# Altium schematic sheet 1 power.SchDoc
size A4; DocumentNumber: 1; SheetNumber: 3; SheetTotal: 12
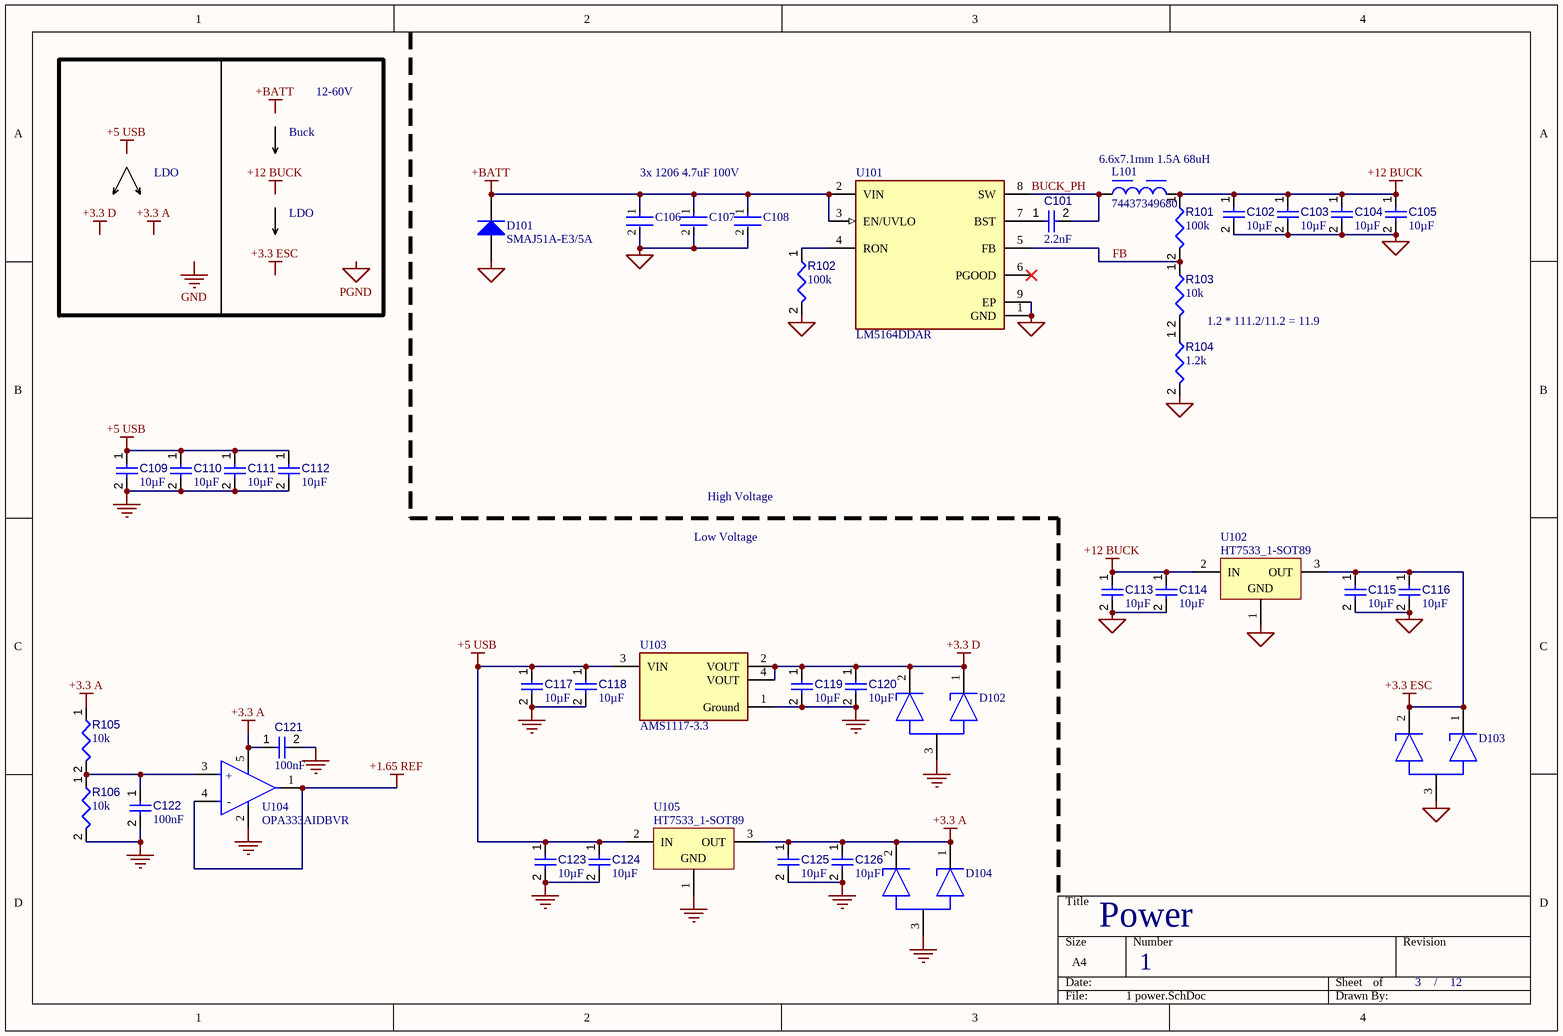
[diagram p0: 1 power.SchDoc]

## Parts
C101  value 2.2nF  [CAPC0402(1005)33_L]  (hidden comment: Capacitor 2.2nF +/-20% 50V 0402)
C102  value 10µF  [CAPC0603(1608)100_L]  (hidden comment: Capacitor 10µF +/-20% 10V 0603)
C103  value 10µF  [CAPC0603(1608)100_L]  (hidden comment: Capacitor 10µF +/-20% 10V 0603)
C104  value 10µF  [CAPC0603(1608)100_L]  (hidden comment: Capacitor 10µF +/-20% 10V 0603)
C105  value 10µF  [CAPC0603(1608)100_L]  (hidden comment: Capacitor 10µF +/-20% 10V 0603)
C106  12061Z475KAT2A  [FP-1206-L_3_2_0_2-W_1_6_0-MFG]  (value not drawn)
C107  12061Z475KAT2A  [FP-1206-L_3_2_0_2-W_1_6_0-MFG]  (value not drawn)
C108  12061Z475KAT2A  [FP-1206-L_3_2_0_2-W_1_6_0-MFG]  (value not drawn)
C109  value 10µF  [CAPC0603(1608)100_L]  (hidden comment: Capacitor 10µF +/-20% 10V 0603)
C110  value 10µF  [CAPC0603(1608)100_L]  (hidden comment: Capacitor 10µF +/-20% 10V 0603)
C111  value 10µF  [CAPC0603(1608)100_L]  (hidden comment: Capacitor 10µF +/-20% 10V 0603)
C112  value 10µF  [CAPC0603(1608)100_L]  (hidden comment: Capacitor 10µF +/-20% 10V 0603)
C113  value 10µF  [CAPC0603(1608)100_L]  (hidden comment: Capacitor 10µF +/-20% 10V 0603)
C114  value 10µF  [CAPC0603(1608)100_L]  (hidden comment: Capacitor 10µF +/-20% 10V 0603)
C115  value 10µF  [CAPC0603(1608)100_L]  (hidden comment: Capacitor 10µF +/-20% 10V 0603)
C116  value 10µF  [CAPC0603(1608)100_L]  (hidden comment: Capacitor 10µF +/-20% 10V 0603)
C117  value 10µF  [CAPC0603(1608)100_L]  (hidden comment: Capacitor 10µF +/-20% 10V 0603)
C118  value 10µF  [CAPC0603(1608)100_L]  (hidden comment: Capacitor 10µF +/-20% 10V 0603)
C119  value 10µF  [CAPC0603(1608)100_L]  (hidden comment: Capacitor 10µF +/-20% 10V 0603)
C120  value 10µF  [CAPC0603(1608)100_L]  (hidden comment: Capacitor 10µF +/-20% 10V 0603)
C121  value 100nF  [CAPC0402(1005)60_L]  (hidden comment: Capacitor 100nF +/-20% 25V 0402)
C122  value 100nF  [CAPC0402(1005)60_L]  (hidden comment: Capacitor 100nF +/-20% 25V 0402)
C123  value 10µF  [CAPC0603(1608)100_L]  (hidden comment: Capacitor 10µF +/-20% 10V 0603)
C124  value 10µF  [CAPC0603(1608)100_L]  (hidden comment: Capacitor 10µF +/-20% 10V 0603)
C125  value 10µF  [CAPC0603(1608)100_L]  (hidden comment: Capacitor 10µF +/-20% 10V 0603)
C126  value 10µF  [CAPC0603(1608)100_L]  (hidden comment: Capacitor 10µF +/-20% 10V 0603)
D101  SMAJ51A-E3/5A  [VISH-DO-214AC-2_N]
D102  PESD3V3S2UT,215  [FP-SOT23-IPC_A]  (value not drawn)
D103  PESD3V3S2UT,215  [FP-SOT23-IPC_A]  (value not drawn)
D104  PESD3V3S2UT,215  [FP-SOT23-IPC_A]  (value not drawn)
L101  74437349680  [WE-LHMI_7050]
R101  value 100k  [RESC0402(1005)_L]  (hidden comment: Resistor 100K +/-1 % 0402 63 mW)
R102  value 100k  [RESC0402(1005)_L]  (hidden comment: Resistor 100K +/-1 % 0402 63 mW)
R103  value 10k  [RESC0402(1005)_L]  (hidden comment: Resistor 10K  +/-1 % 0402 63 mW)
R104  value 1.2k  [RESC0402(1005)_L]  (hidden comment: Resistor 1K2 +/-1 % 0402 63 mW)
R105  value 10k  [RESC0402(1005)_L]  (hidden comment: Resistor 10K  +/-1 % 0402 63 mW)
R106  value 10k  [RESC0402(1005)_L]  (hidden comment: Resistor 10K  +/-1 % 0402 63 mW)
U101  LM5164DDAR  [FP-DDA0008E-MFG]
U102  HT7533_1-SOT89  [SOT89_L]
U103  AMS1117-3.3  [FP-AMS1117-IPC_C]
U104  OPA333AIDBVR  [FP-DBV0005A-MFG]
U105  HT7533_1-SOT89  [SOT89_L]

## Nets
+1.65 REF: U104.1(OUT) U104.4(-IN)
+3.3 A: C121.1 C125.1 C126.1 D104.1 D104.2 R105.1 U104.5(V+) U105.3(OUT)
+3.3 D: C119.1 C120.1 D102.1 D102.2 U103.2(VOUT) U103.4(VOUT)
+3.3 ESC: C115.1 C116.1 D103.1 D103.2 U102.3(OUT)
+5 USB: C109.1 C110.1 C111.1 C112.1 C117.1 C118.1 C123.1 C124.1 U103.3(VIN) U105.2(IN)
+12 BUCK: C102.1 C103.1 C104.1 C105.1 C113.1 C114.1 L101.2 R101.1 U102.2(IN)
+BATT: C106.1 C107.1 C108.1 D101.1(K) U101.2(VIN) U101.3(EN/UVLO)
GND: C109.2 C110.2 C111.2 C112.2 C117.2 C118.2 C119.2 C120.2 C121.2 C122.2 C123.2 C124.2 C125.2 C126.2 D102.3 D104.3 R106.2 U103.1(Ground) U104.2(V-) U105.1(GND)
PGND: C102.2 C103.2 C104.2 C105.2 C106.2 C107.2 C108.2 C113.2 C114.2 C115.2 C116.2 D101.2(A) D103.3 R102.2 R104.2 U101.1(GND) U101.9(EP) U102.1(GND)
BUCK_PH: C101.2 L101.1 U101.8(SW)
FB: R101.2 R103.1 U101.5(FB)
NetC101_1: C101.1 U101.7(BST)
NetC122_1: C122.1 R105.2 R106.1 U104.3(+IN)
NetR102_1: R102.1 U101.4(RON)
NetR103_2: R103.2 R104.1

Not connected (* = marked no-connect by the designer): U101 6(PGOOD)*

## Notes on the sheet
- 12-60V
- LDO
- Buck
- 3x 1206 4.7uF 100V
- 6.6x7.1mm 1.5A 68uH
- 1.2 * 111.2/11.2 = 11.9
- High Voltage
- Low Voltage
- Power
- /
- Labels drawn without touching a wire or pin: +3.3 A, +3.3 D, +3.3 ESC, +5 USB, +12 BUCK, +BATT, GND, PGND
- (in symbol CMP-0272-00862-4) +; -

## Library data of the parts
C101 = CMP-001-00066-3: Chip Capacitor, 1nF +/-20%, 50V, 0402, Thickness 0.33 mm; Tolerance: 10%; Case/Package: 0402; Pins: 2; Min Operating Temperature: -55°C; Max Operating Temperature: 85°C; Voltage Rating: 50V; Mounting Technology: SMT
C102-C105 C109-C120 C123-C126 = CMP-001-00075-4: Chip Capacitor, 10µF +/-20%, 10V, 0603, Thickness 1 mm; Tolerance: 10%; Voltage Rating: 10V; Max Operating Temperature: 85°C; Pins: 2; Case/Package: 0603; Mounting Technology: SMT; Min Operating Temperature: -55°C
C106-C108 = CMP-2000-05019-2: CAP CER 4.7UF 100V X7S 1206; Tolerance: 10%; Thickness: 0.075inch; Max Operating Temperature: 125°C; Termination: SMD/SMT; Dielectric: X7S; Case Code (Metric): 3216; Case/Package: 1206; Height: 0.5mm; Mount: Surface Mount; Voltage Rating (DC): 100V; Min Operating Temperature: -55°C; Package Quantity: 1; Length: 3.2mm; Voltage Rating: 100V; Lead Free: Lead Free; RoHS Compliant: Yes; Packaging: Tape and Reel; Weight: 0.000571oz; Capacitance: 4.7uF; REACH SVHC: No SVHC; Case Code (Imperial): 1206; Width: 0.063inch; Depth: 1.6mm
C121 C122 = CMP-001-00065-4: Chip Capacitor, 100nF +/-20%, 25V, 0402, Thickness 0.6 mm; Tolerance: 10%; Max Operating Temperature: 85°C; Min Operating Temperature: -55°C; Pins: 2; Voltage Rating: 25V; Mounting Technology: SMT; Case/Package: 0402
D101 = CMP-0544-00031-2: Transient Voltage Suppressor, 6.40 to 231 V, 51 V Stand-off Voltage, Uni-Directional, -55 to 155 degC, 2-pin DO-214AC, Pb-Free, Tape and Reel; Manufacturer: Vishay Semiconductor; IFSM: 40 A; ID (uA): 1; VBR Uni-Directional (V): 6.4 to 231; PPPM (W): 400, 300; VWM (V): 51; ComponentLink3Description: Package Specification; PackageDescription: 2-Pin DO-214AC (SMA), Body 4.245 x 2.665 mm; ComponentLink1Description: Manufacturer URL; ComponentLink2Description: Datasheet; ComponentLink3URL: http://www.vishay.com/docs/88390/smaj50a.pdf; DatasheetVersion: 12/8/2013; ComponentLink2URL: http://www.vishay.com/docs/88390/smaj50a.pdf; PackageReference: DO-214AC-2; RoHS: TRUE; Operating Junction and Storage Temperature Range: -55 to 150 degC; ComponentLink1URL: http://www.vishay.com/; PartNumber: SMAJ51A-E3/5A; Packing: Tape and Reel; Mounting Technology: Surface Mount
D102-D104 = CMP-14432-000008-1: TVS DIODE 3.3VWM 20VC TO236AB; RoHS Compliant: Yes
L101 = CMP-1353-00069-6: NexarPartId: 65255814; Inductance Tolerance: 20%; Saturation Current: 1.45A; Inductance: 68µH; DC Resistance (DCR): 386mΩ; Ambient Temperature Range High: 85°C; Ambient Temperature Range Low: -40°C; RoHS: Compliant; Length: 7.3mm; Min Operating Temperature: -40°C; Max Operating Temperature: 125°C; Height: 4.8mm; Width: 6.6mm
R101 R102 = CMP-009-00168-3: Chip Resistor, 100 kOhms, +/-1 %, 63 mW, -55 to 155 degC, 0402; Tolerance: 1%; Power: 63mW; Max Operating Temperature: 155°C; Min Operating Temperature: -55°C; Pins: 2; Case/Package: 0402
R103 R105 R106 = CMP-009-00149-3: Chip Resistor, 10 kOhms, +/-1 %, 63 mW, -55 to 125 degC, 0402; Power: 63mW; Tolerance: 1%; Min Operating Temperature: -55°C; Case/Package: 0402; Max Operating Temperature: 155°C; Pins: 2
R104 = CMP-009-00157-3: Chip Resistor, 1.2 kOhms, +/-1 %, 63 mW, -55 to 155 degC, 0402; Tolerance: 1%; Power: 63mW; Case/Package: 0402; Pins: 2; Min Operating Temperature: -55°C; Max Operating Temperature: 155°C
U101 = CMP-04918-000011-1: POWER MANAGEMENT; Manufacturer: Texas Instruments; Standoff Height: 0mm; Max Supply Voltage: 100V; Output Voltage: 1.2-90V; Max Duty Cycle: 99%; Nominal Supply Current: 600uA; Output Current: 1A; Min Supply Voltage: 6V; Output Type: AdjustableProgrammable; Max Junction Temp: +150°C; Number Of Outputs: 1; Switching Frequency: 1000kHz; Switching Topology: Buck; Temperature: -40°C to +150°C; Device Class L1: Integrated Circuits (ICs); Automotive: No; Lead Free: Yes; Package: DDA0008E; Device Class L3: Voltage Regulators - Switching; Manufacturer Part Number: LM5164DDAR; Device Class L2: Power Management ICs; RoHS: TRUE; Mouser Description: 6-V to 100-V input, 1-A synchronous buck DC-DC converter with ultra-low IQ 8-SO PowerPAD -40 to 150; Temperature Range Low: -40°C; ComponentLink2Description: Datasheet; Temperature Range High: +150°C; ComponentLink2URL: http://www.ti.com/lit/ds/symlink/lm5164.pdf; Digikey Description: POWER MANAGEMENT; Category: IC; Octopart: https://octopart.com/lm5164ddar-texas+instruments-96785744
U102 U105 = CMP-0204-00101-1: 100mA Low Power LDO, Output Voltage 3.3V, SOT89 Pkg; DatasheetVersion: Rev1.80, Mar-2010; PackageDescription: 3-Pin SOT-89 Package 1.5 mm Pitch, 4.1 mm Lead Span; PackageReference: SOT89; PackageVersion: May-2010; Code_IPC: SOT89
U103 = CMP-209535-000001-1: LDO Voltage Regulators 1A, 3.3V; Manufacturer: Advanced Monolithic Systems; Dropout Voltage: 1.1V; Output Type: Fixed; Nominal Supply Current: 5mA; Max Power Dissipation: 1.2W; Max Supply Voltage: 15V; Number Of Outputs: 1; Standoff Height: 0.64mm; Max Junction Temp: +125°C; Height: 1.8mm; Package: AMS1117; Device Class L2: Power Management ICs; ComponentLink2Description: Datasheet; ComponentLink2URL: http://www.advanced-monolithic.com/pdf/ds1117.pdf; Category: IC; RoHS: TRUE; Automotive: No; Device Class L1: Integrated Circuits (ICs); Output Current: 1A; Device Class L3: Voltage Regulators - Linear; Temperature: -40°C to +125°C; Output Voltage: 3.3V; Manufacturer Part Number: AMS1117-3.3; Temperature Range Low: -40°C; Octopart: https://octopart.com/ams1117-3.3-advanced+monolithic+systems-25899300; Lead Free: Yes; Ipc Land Pattern Name: SOT229P700X180-4; Temperature Range High: +125°C; JLCPCB Part #: C6186
U104 = CMP-0272-00862-4: IC OPAMP ZER-DRIFT 1CIRC SOT23-5; Number of Elements: 1; Common Mode Rejection Ratio: 106dB; Max Supply Voltage: 5.5V; Min Supply Voltage: 1.8V; Max I/O Voltage: 10uV; Output Current per Channel: 5mA; Max Dual Supply Voltage: 2.75V; Operating Supply Current: 17uA; Nominal Supply Current: 25uA; Bandwidth: 350kHz; Min Dual Supply Voltage: 900mV; Power Supply Rejection Ratio (PSRR): 120dB; Voltage Gain: 130dB; Input Bias Current: 200pA; Slew Rate: 0.16V/µs; Number of Channels: 1; Max Operating Temperature: 125°C; REACH SVHC: No SVHC; Number of Amplifiers: 1; Input Offset Voltage (Vos): 10uV; Radiation Hardening: No; Lead Free: Lead Free; Operating Supply Voltage: 2.75V; Min Operating Temperature: -40°C; Contact Plating: Gold; Number of Pins: 5; Output Current: 5mA; Packaging: Tape and Reel; Unity Gain Bandwidth Product: 350kHz; Number of Circuits: 1; Gain Bandwidth Product: 350kHz; Case/Package: SOT-23-5; Package Quantity: 1